# EAGLE design Discharge Board (EAGLE 9.6.2)
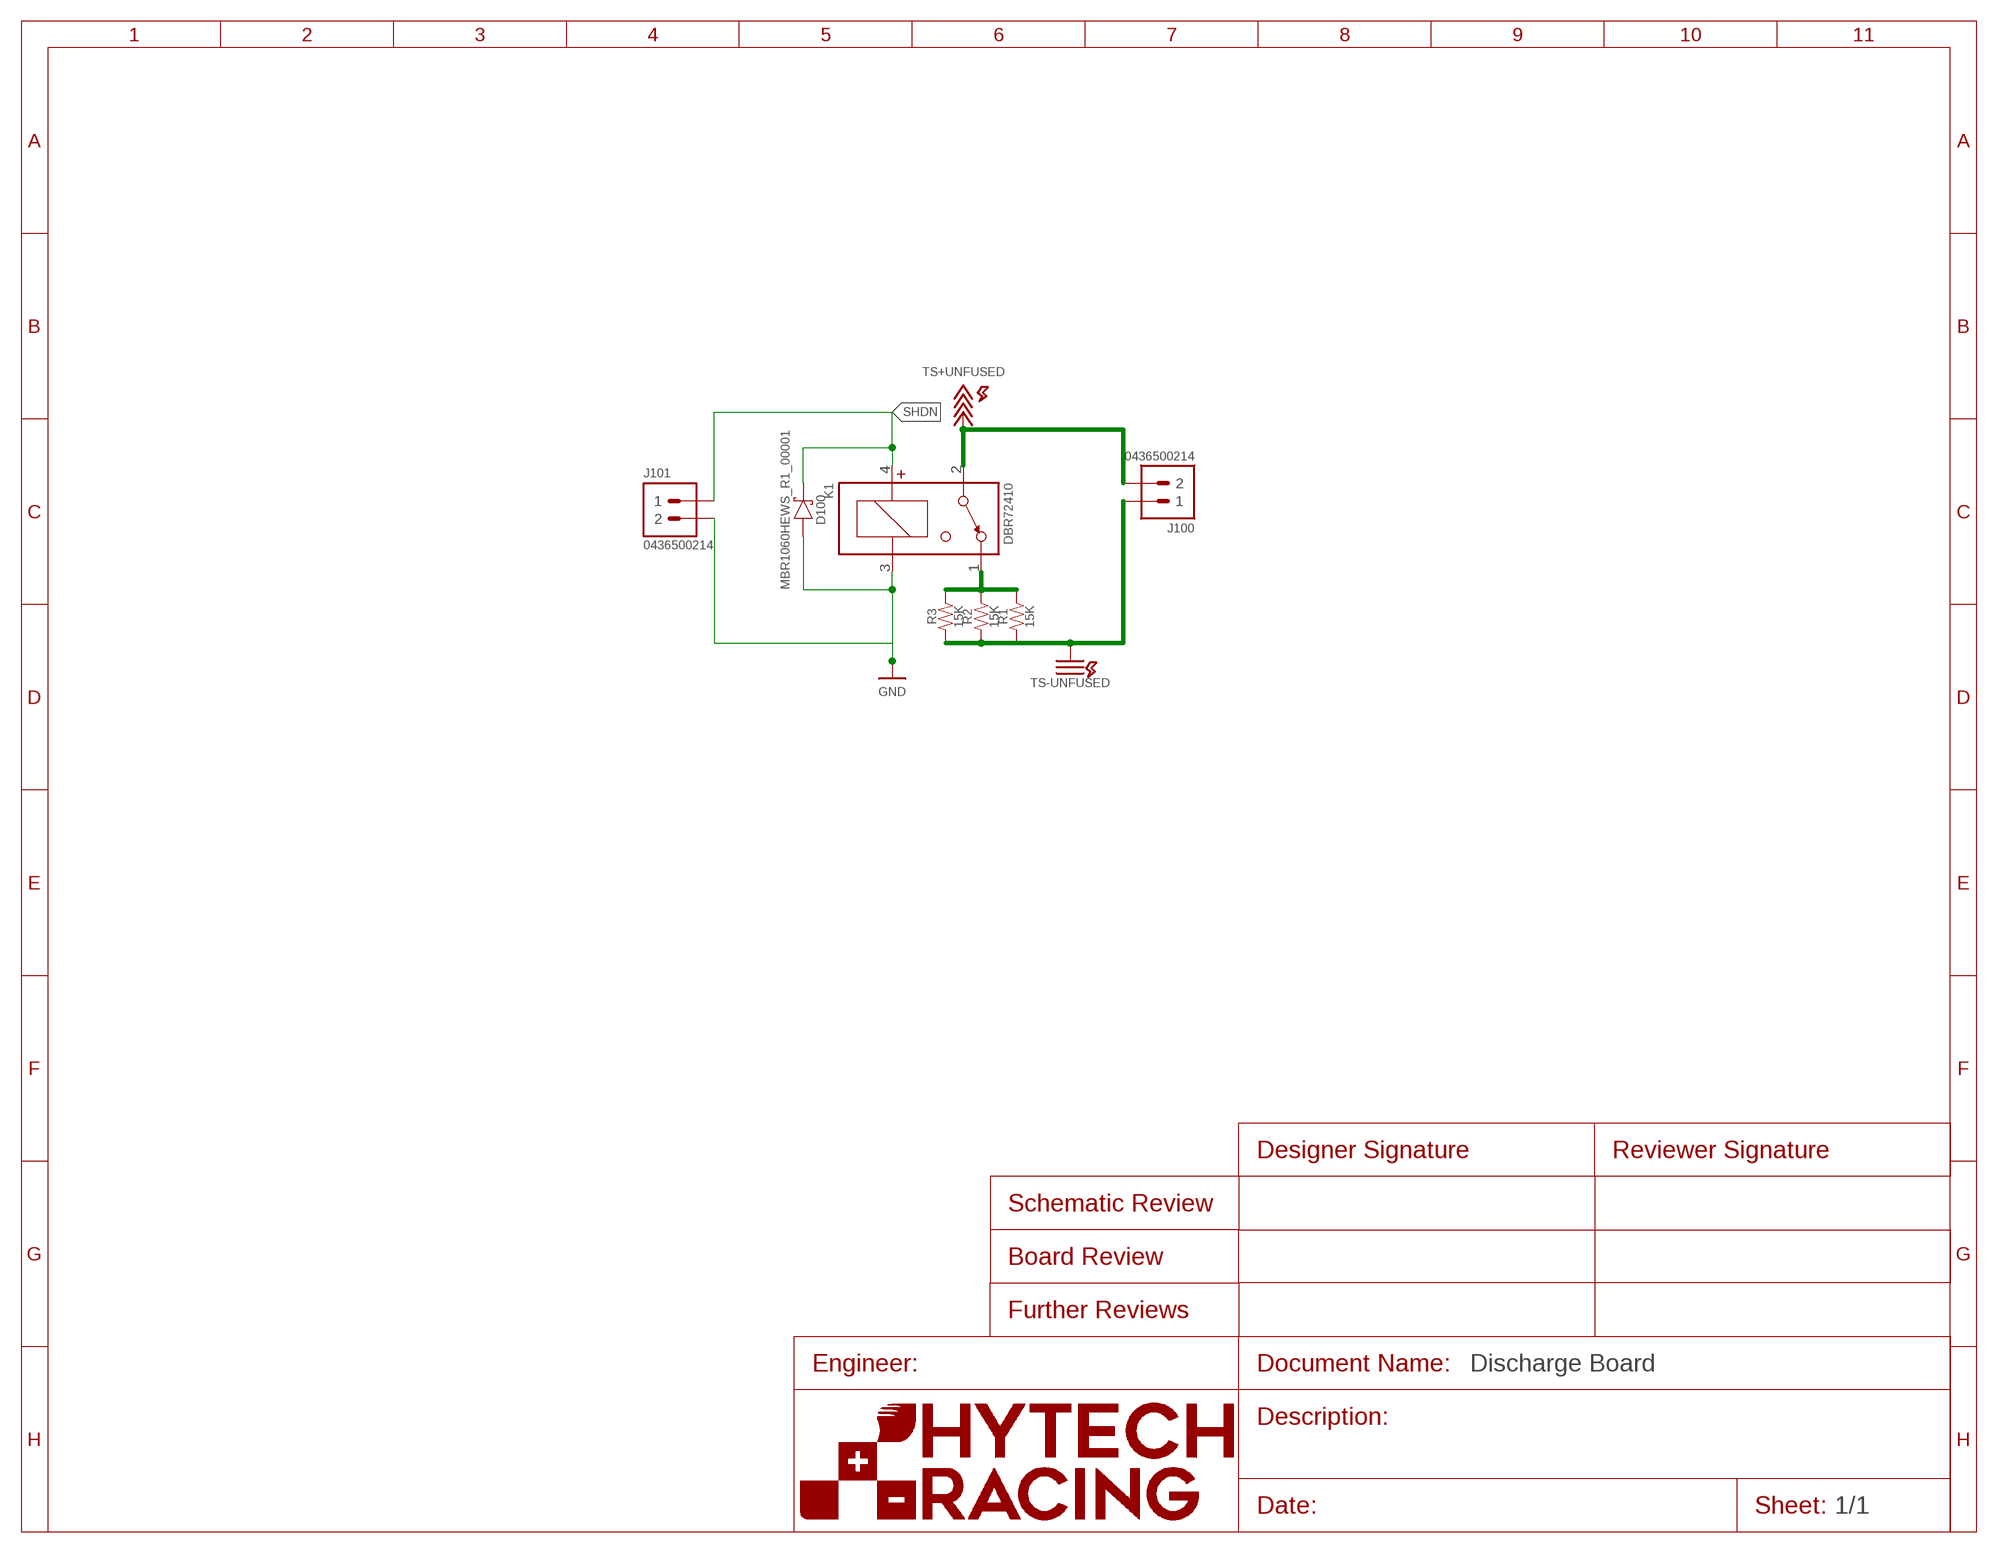
[diagram p0: schematic, sheet 1]

## Parts
D100  SCHOTTKY_SOD323_60V  [SOD-323]
J100  CONNECTOR-2_MICROFIT_SMD_RIGHTANGLE_02_SINGLE_BLACK  [MOLEX_MICROFIT_SMD_RIGHTANGLE_02_SINGLE]
J101  CONNECTOR-2_MICROFIT_SMD_RIGHTANGLE_02_SINGLE_BLACK  [MOLEX_MICROFIT_SMD_RIGHTANGLE_02_SINGLE]
K1  RELAY_SPST_NC_POLARIZED_D_24  [D]
R1  RESISTOR_B20-SHORTENED_15K  [B20-SHORTENED]
R2  RESISTOR_B20-SHORTENED_15K  [B20-SHORTENED]
R3  RESISTOR_B20-SHORTENED_15K  [B20-SHORTENED]

## Nets
GND: D100.A J101.2 K1.3(COIL-)
N$5: J100.1 R1.1 R2.1 R3.1 ; supply symbol labelled TS-UNFUSED
N$51: K1.1(CONTACT2) R1.2 R2.2 R3.2
SHDN: D100.C J101.1 K1.4(COIL+)
TS+UNFUSED: J100.2 K1.2(CONTACT1)

## Library data of the parts
D100 = HyTechDevices:SCHOTTKY_?_*: CUS08F30 Shottky Diode Datasheet <https://www.mouser.com/datasheet/2/408/CUS08F30_datasheet_en_20140414-1916097.pdf>; CURRENT: 1A; DKPN: 3757-MBR1060HEWS_R1_00001TR-ND; MANUFACTURER: Panjit International Inc.; MOPN: 241-MBR1060HEWSR1000; MPN: MBR1060HEWS_R1_00001; VOLTAGE: 60V
J100 J101 = HyTechDevices:CONNECTOR-2_?_*: 2 Pin Connector; DKPN: WM14310CT-ND; MANUFACTURER: Molex; MOPN: 538-43650-0214; MPN: 0436500214
K1 = HyTechDevices:RELAY_SPST_NC_POLARIZED_?*: Single Pole, Single Throw Normally Closed Polarized Relay 355x Series <https://www.comus-intl.com/wp-content/uploads/2017/01/High-Voltage-Reed-Relays.pdf> D Series <https://www.mouser.com/datasheet/2/657/cynergy3_d_pcb_v2-1892244.pdf>; DKPN: 725-1050-ND; MANUFACTURER: Sensata-Cynergy3; MOPN: 285-DBR72410; MPN: DBR72410
R1-R3 = HyTechDevices:RESISTOR_?_*: Resistor PWR163 Series <https://www.mouser.com/datasheet/2/54/pwr163-777985.pdf> AC Series <https://www.mouser.com/datasheet/2/447/Yageo_PYu_AC_51_RoHS_L_7_1714230-1874691.pdf> PU Series <https://www.mouser.com/datasheet/2/447/PYu-PU_51_RoHS_L_6-1504619.pdf> ERA Series <https://www.mouser.com/datasheet/2/315/AOA0000C307-1149632.pdf> PWR263 Series <https://www.mouser.com/datasheet/2/54/pwr263s_35-778069.pdf> KTR Series <https://www.mouser.com/datasheet/2/348/ROHM_S_A0011075115_1-2563276.pdf> RC Series <https://www.mouser.com/datasheet/2/447/Yageo_03_18_2021_PYu_RC_Group_51_RoHS_L_11-2199992.pdf> ERJ PB3, PB6 Series <https://www.mouser.com/datasheet/2/315/AOA0000C328-1530132.pdf> ERJ PA2, P03, PA3, P06, P08, P14 Series <https://www.mouser.com/datasheet/2/315/AOA0000C331-1141874.pdf> B20 Series <https://www.ohmite.com/assets/docs/res_200.pdf?r=false> TE Connectivity/Holsworthy RN73 Series <https://www.mouser.com/datasheet/2/418/4/NG_DS_1773270_M-604713.pdf> Vishay Dale D/CRCW e3 <https://www.mouser.com/datasheet/2/427/dcrcwe3-1762152.pdf> Ohmite B20 <https://www.ohmite.com/assets/docs/res_200.pdf?r=false>; DKPN: B20J15KE-ND; MANUFACTURER: Ohmite; MOPN: 588-B20J15KE; MPN: B20J15KE; POWER: 20W; RESISTANCE: 15K; TOLERANCE: 5%; VOLTAGE_CONTINUOUS: 548V; VOLTAGE_MAX: 750V

## Board
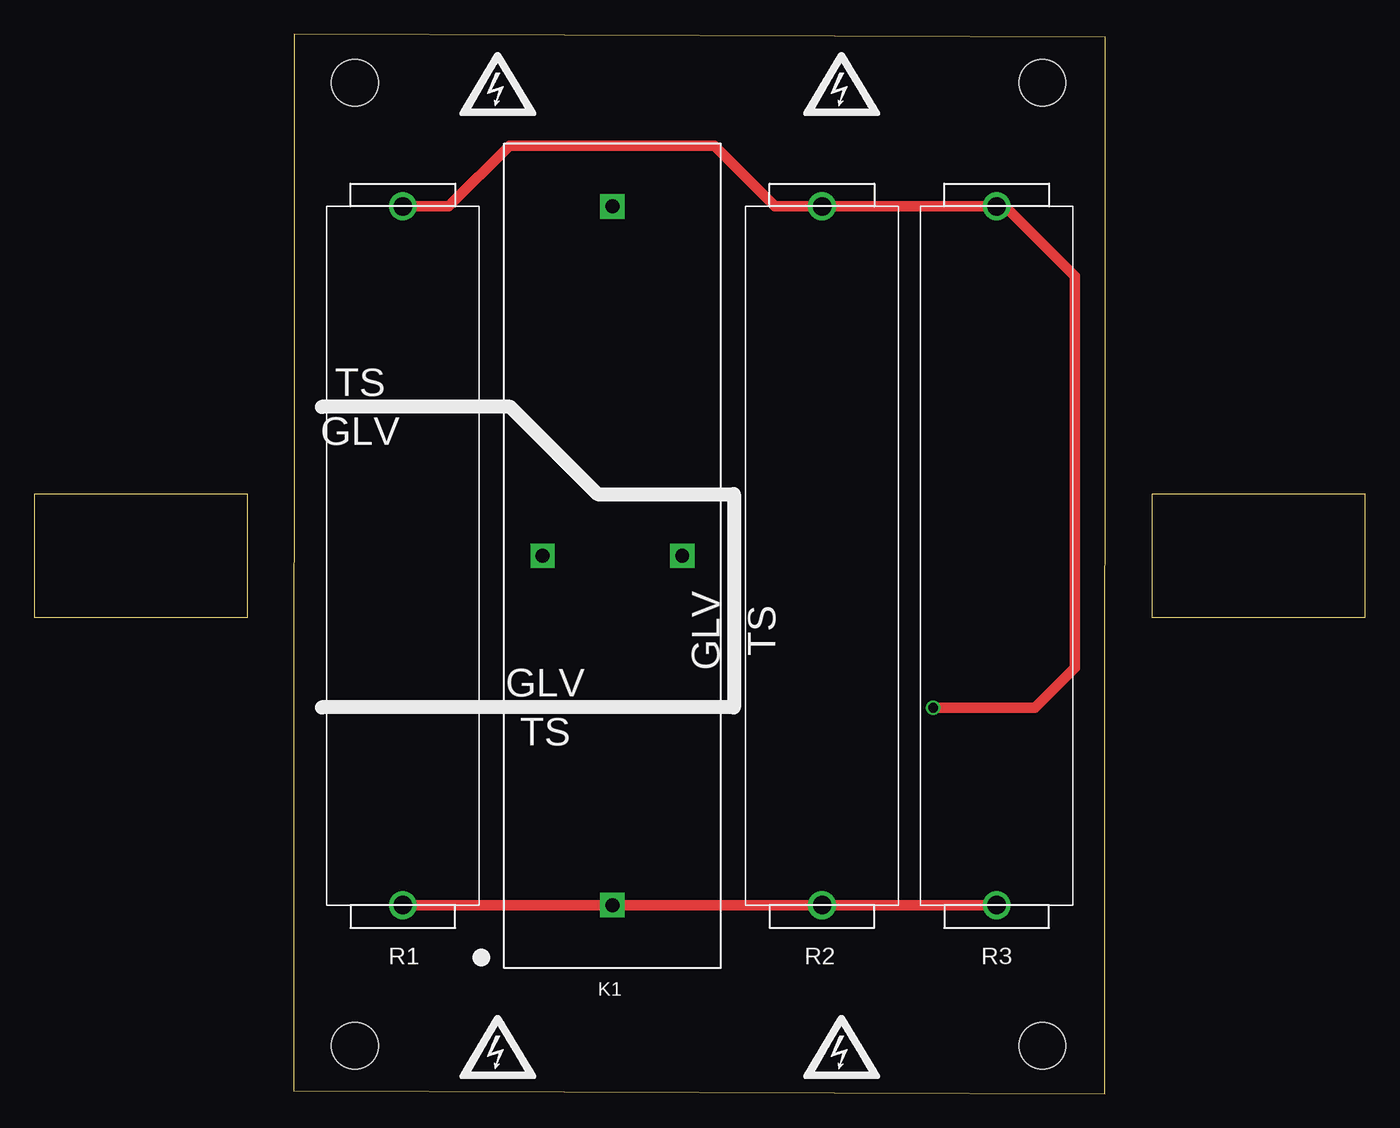
[diagram p1: board, top side]
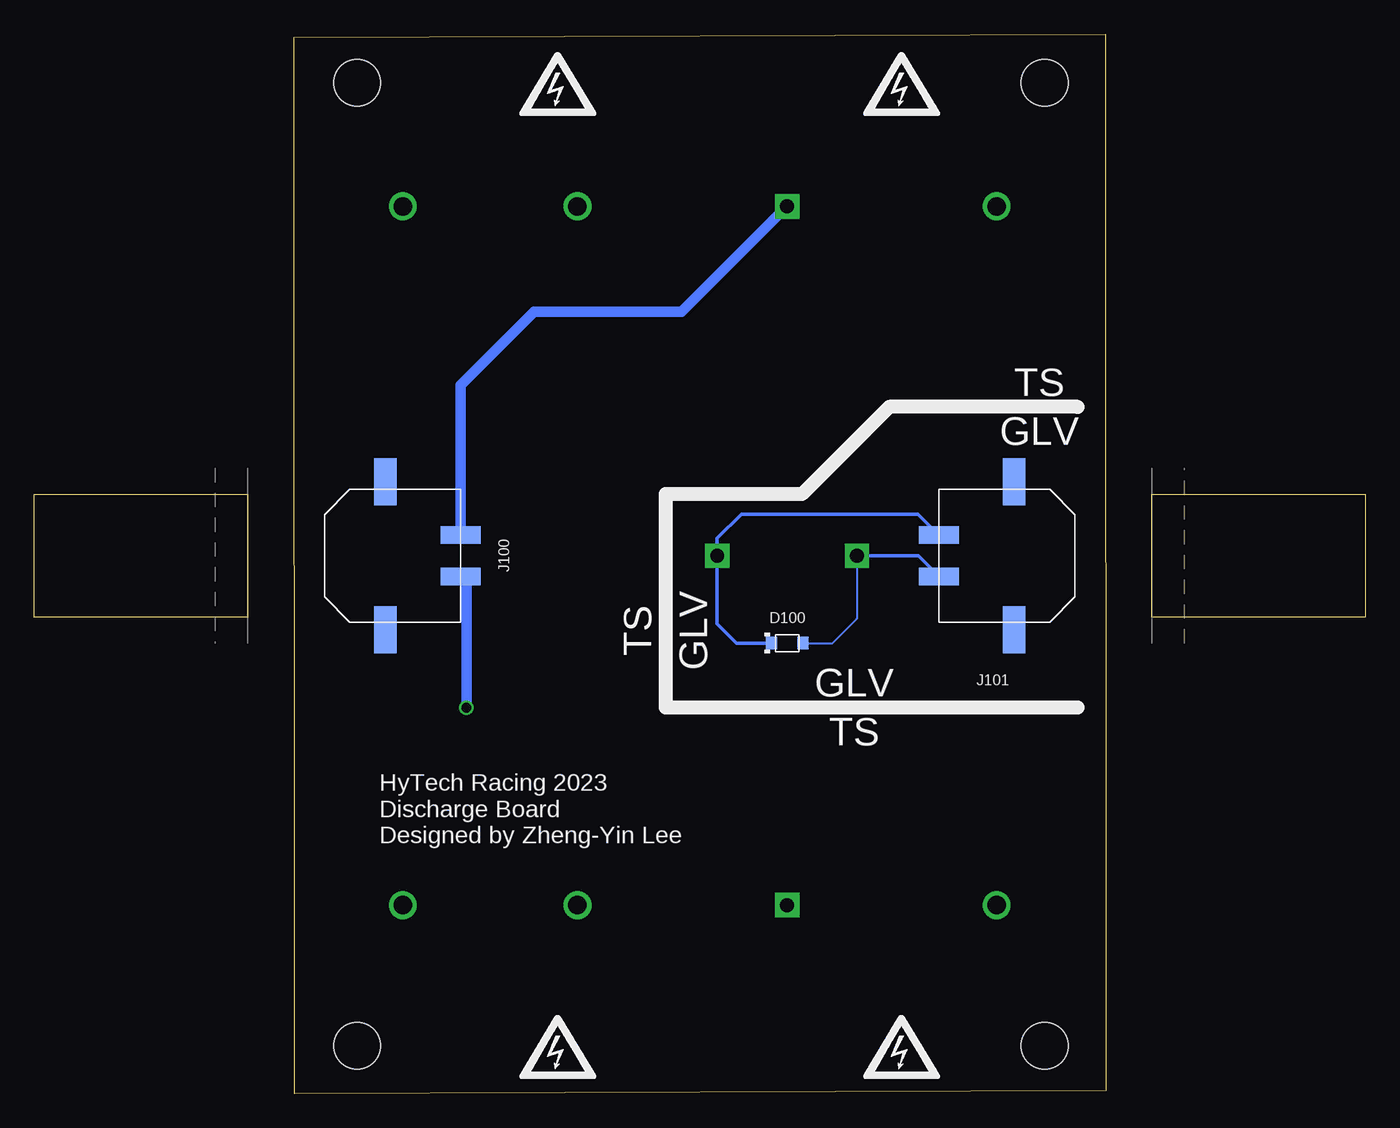
[diagram p2: board, bottom side, seen from below]

Size 59.03 x 77 mm. Coordinates in mm from the lower left corner, seen from the top.
Outline: 0,0.2 58.99,0 59.03,76.8 0.04,77 0,0.2
Copper layers (1*16): Top 0.035mm / dielectric 1.53mm / Bottom 0.035mm
Design rules "JLCPCB (2 Layer)": minimum track width 5mil, minimum drill 0.3mm, track to track 5mil, track to pad 5mil, pad to pad 5mil, via to via 20mil, smd to smd 5mil, copper to edge 0.2mm, drill to drill 21mil, minimum pad ring 6mil, minimum via ring 6mil, stop-mask expansion 6mil, vias tented up to drill 30mil, thermal gap 10mil

### Footprints (pad centres in the part's own frame; a part is rotated, then mirrored left to right if it is on the bottom)
SOD-323 = smd 0.8 x 0.9: A -1.15,0; C 1.15,0
MOLEX_MICROFIT_SMD_RIGHTANGLE_02_SINGLE = smd 1.27 x 2.921: 1 1.499,5.474; 2 -1.499,5.474 | smd 3.429 x 1.651: PAD1 5.372,0; PAD2 -5.372,0
D = drill 1 pad 1.778 square: 1 -25.4,0; 2 25.4,0; 3 0,5.08; 4 0,-5.08
B20-SHORTENED = drill 1.35: 1 25.4,0; 2 -25.4,0
MOUNTING_M3 = hole 3.4: 0,0

### Placement (x,y rotation side)
D100  23.18,32.75 180 bottom
J100  52.39,39.1 270 bottom
J101  6.67,39.1 90 bottom
K1  23.18,39.1 90 top
R1  7.94,39.1 90 top
R2  38.42,39.1 90 top
R3  51.12,39.1 90 top
U$1  [GLV]  4.83,48.14 0 top
U$2  [GLV]  18.3,29.85 180 top
U$3  [TS]  4.83,51.7 0 top
U$4  [TS]  18.3,26.3 0 top
U$5  [GLV]  29.98,33.66 90 top
U$6  [TS]  34.04,33.66 90 top
U$7  [HV_MEDIUM]  14.85,3.39 0 top
U$8  [HV_MEDIUM]  14.85,73.39 0 top
U$9  [HV_MEDIUM]  39.85,3.39 0 top
U$10  [HV_MEDIUM]  39.85,73.39 0 top
U$11  [HV_MEDIUM]  39.85,73.39 0 bottom
U$12  [HV_MEDIUM]  14.85,73.39 0 bottom
U$13  [HV_MEDIUM]  39.85,3.39 0 bottom
U$14  [HV_MEDIUM]  14.85,3.39 0 bottom
U$15  [MOUNTING_M3]  4.45,3.49 0 top
U$16  [MOUNTING_M3]  54.45,3.49 0 top
U$17  [MOUNTING_M3]  4.45,73.49 0 top
U$18  [MOUNTING_M3]  54.45,73.49 0 top

### Tracks (layer width: path | path; a pad name or v marks a point on that pad's centre or on a via)
GND
  Bottom 0.152: D100.A 19.88,32.75 18.1,34.52 K1.3
  Bottom 0.254: J101.2 13.64,39.1 K1.3
N$5  (via drill 0.7)
  Top 0.508: R3.1 51.71,64.5
  Top 0.762: R3.1 R2.1 35.02,64.5 30.6,68.92 15.69,68.92 11.27,64.5 R1.1 | 51.71,64.5 56.8,59.41 56.8,30.95 53.9,28.05 v46.5,28.05
  Bottom 0.762: v46.5,28.05 46.5,37.18 J100.1
N$51
  Top 0.762: R1.2 K1.1 R2.2 R3.2
SHDN
  Bottom 0.254: D100.C 26.87,32.75 28.26,34.14 K1.4 28.26,40.37 26.51,42.12 13.67,42.12 J101.1
TS+UNFUSED
  Bottom 0.152: 46.69,40.37 J100.2
  Bottom 0.762: K1.2 30.85,56.83 41.59,56.83 46.92,51.5 J100.2

### Text on the board
bPlace: HyTech Racing 2023 / Discharge Board / Designed by Zheng-Yin Lee